# Altium project Cam_control.PrjPCB
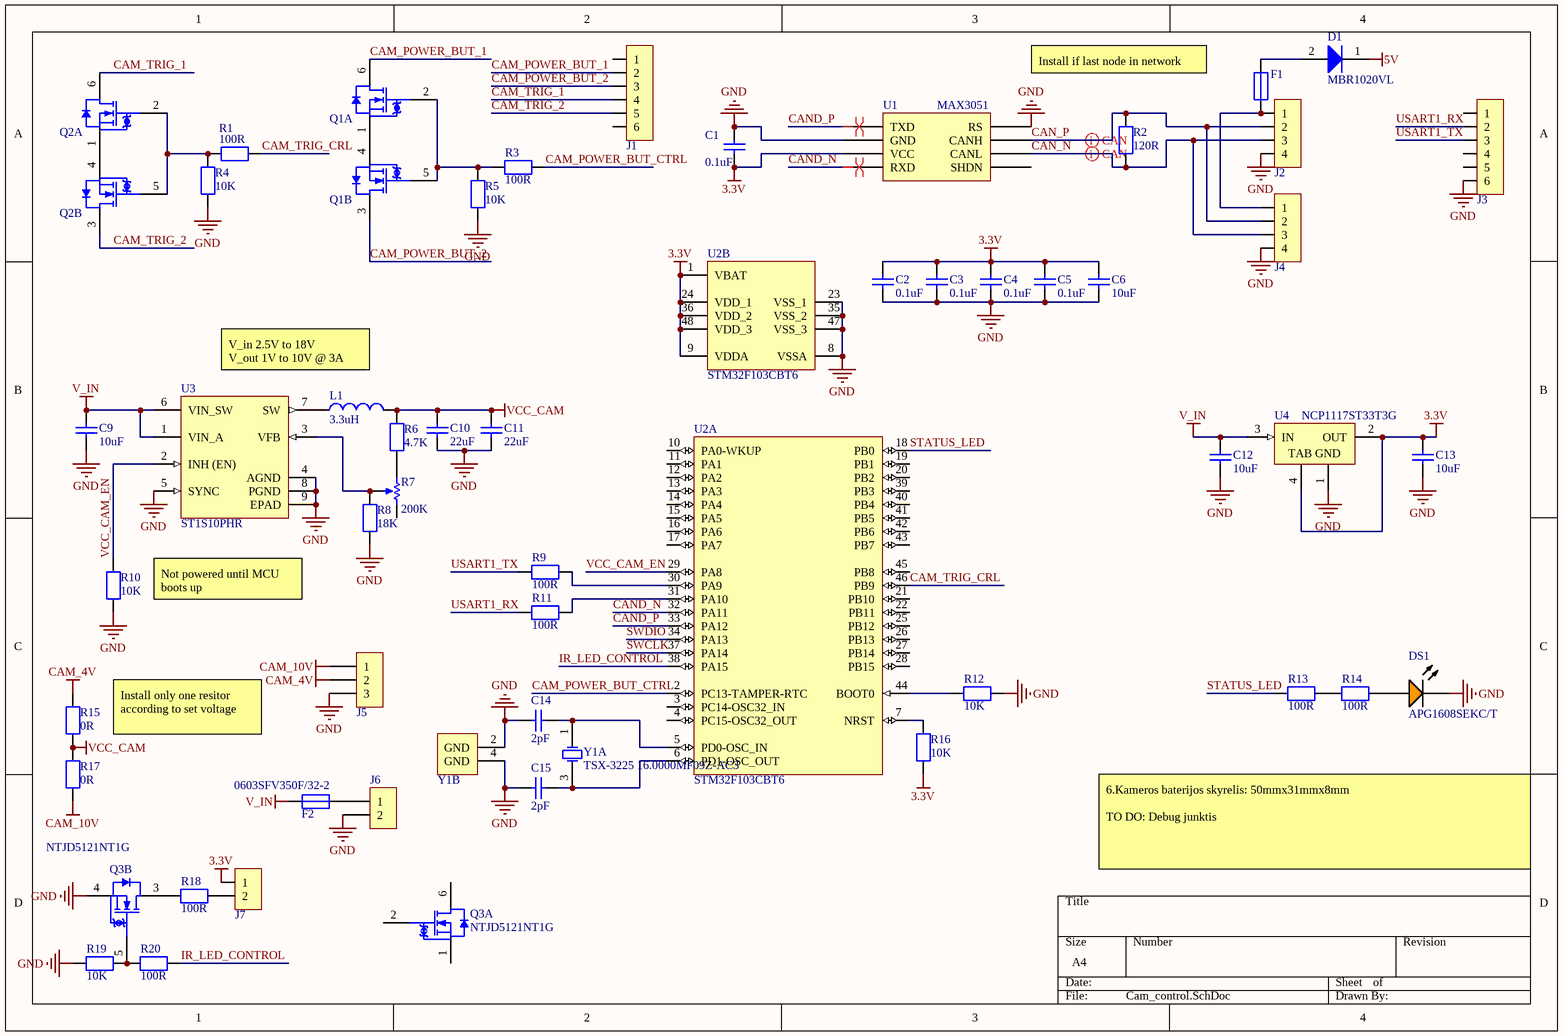
[diagram p0: Cam_control.SchDoc]
1 sheet, 53 parts. Net scope: global (net labels, ports and power ports of the same name join across sheets).
Board file: Cam_control.PcbDoc

## Sheet Cam_control.SchDoc
size A4; Author: Matas

### Parts
C1  value 0.1uF  [0603_CAP]  (hidden comment: Capacitor)
C2  value 0.1uF  [0603_CAP]  (hidden comment: Capacitor)
C3  value 0.1uF  [0603_CAP]  (hidden comment: Capacitor)
C4  value 0.1uF  [0603_CAP]  (hidden comment: Capacitor)
C5  value 0.1uF  [0603_CAP]  (hidden comment: Capacitor)
C6  value 10uF  [1206_CAP]  (hidden comment: Capacitor)
C9  value 10uF  [1206_CAP]  (hidden comment: Capacitor)
C10  value 22uF  [0805_CAP]  (hidden comment: Capacitor)
C11  value 22uF  [0805_CAP]  (hidden comment: Capacitor)
C12  value 10uF  [1206_CAP]  (hidden comment: Capacitor)
C13  value 10uF  [1206_CAP]  (hidden comment: Capacitor)
C14  value 2pF  [0603_CAP]  (hidden comment: Capacitor)
C15  value 2pF  [0603_CAP]  (hidden comment: Capacitor)
D1  MBR1020VL  [SOD-123-2]
DS1  APG1608SEKC/T  [KING-LED0603-25-ORANGE_V]
F1  Fuse  [0603_RES]  (value not drawn)
F2  0603SFV350F/32-2  [0603_RES]
J1  DF13-6P / 1.25mm Pitch Miniature Crimping Connector.  [DF13-6P-1.25DS]  (value not drawn)
J2  DF13-4P / 1.25mm Pitch Miniature Crimping Connector.  [DF13-4P-1.25DS]  (value not drawn)
J3  DF13-6P / 1.25mm Pitch Miniature Crimping Connector.  [DF13-6P-1.25DS]  (value not drawn)
J4  DF13-4P / 1.25mm Pitch Miniature Crimping Connector.  [DF13-4P-1.25DS]  (value not drawn)
J5  Molex - Micro-Fit 3.0 Series connector,  3.00mm (0.118") pitch header, 3 positions.  [43650-0300]  (value not drawn)
J6  Micro-Fit 3.0, 3.00mm pitch header  [43650-0200]  (value not drawn)
J7  DF13-2P / 1.25mm Pitch Miniature Crimping Connector.  [DF13-2P-1.25DS]  (value not drawn)
L1  value 3.3uH  [ASPI0530]  (hidden comment: Inductor)
Q1  NTJD5121NT1G  [ONSC-SC70-6-419B-02_V]  (value not drawn)  (parts A,B of 2)
Q2  NTJD5121NT1G  [ONSC-SC70-6-419B-02_V]  (value not drawn)  (parts A,B of 2)
Q3  NTJD5121NT1G  [ONSC-SC70-6-419B-02_V]  (parts A,B of 2)
R1  value 100R  [0603_RES]  (hidden comment: Resitor)
R2  value 120R  [0603_RES]  (hidden comment: Resitor)
R3  value 100R  [0603_RES]  (hidden comment: Resitor)
R4  value 10K  [0603_RES]  (hidden comment: Resitor)
R5  value 10K  [0603_RES]  (hidden comment: Resitor)
R6  value 4.7K  [0603_RES]  (hidden comment: Resitor)
R7  value 200K  [TC33X-2]  (hidden comment: Potenciometer)
R8  value 18K  [0603_RES]  (hidden comment: Resitor)
R9  value 100R  [0603_RES]  (hidden comment: Resitor)
R10  value 10K  [0603_RES]  (hidden comment: Resitor)
R11  value 100R  [0603_RES]  (hidden comment: Resitor)
R12  value 10K  [0603_RES]  (hidden comment: Resitor)
R13  value 100R  [0603_RES]  (hidden comment: Resitor)
R14  value 100R  [0603_RES]  (hidden comment: Resitor)
R15  value 0R  [0603_RES]  (hidden comment: Resitor)
R16  value 10K  [0603_RES]  (hidden comment: Resitor)
R17  value 0R  [0603_RES]  (hidden comment: Resitor)
R18  value 100R  [0603_RES]  (hidden comment: Resitor)
R19  value 10K  [0603_RES]  (hidden comment: Resitor)
R20  value 100R  [0603_RES]  (hidden comment: Resitor)
U1  MAX3051  [SOIC127P600X175-8M]
U2  STM32F103CBT6  [STM-LQFP48_L]  (parts A,B of 2)
U3  ST1S10PHR  [HSO-8_L]
U4  NCP1117ST33T3G  [ONSC-SOT-223_M]
Y1  TSX-3225 16.0000MF09Z-AC3  [TSX-3225]  (parts A,B of 2)

### Nets
3.3V: C1.1 C2.2 C3.2 C4.2 C5.2 C6.2 C13.2 J7.1 R16.1 U1.3(VCC) U2.1(VBAT) U2.9(VDDA) U2.24(VDD_1) U2.36(VDD_2) U2.48(VDD_3) U4.2(OUT) U4.4(TAB)
5V: D1.1(K)
CAM_4V: J5.2 R15.2
CAM_10V: J5.1 R17.1
GND: C1.2 C2.1 C3.1 C4.1 C5.1 C6.1 C9.1 C10.1 C11.1 C12.1 C13.1 C14.1 C15.1 DS1.2(K) J2.4 J3.6 J4.4 J5.3 J6.2 Q3.4(S2) R4.1 R5.1 R8.1 R10.1 R12.1 R19.2 U1.2(GND) U1.8(RS) U2.8(VSSA) U2.23(VSS_1) U2.35(VSS_2) U2.47(VSS_3) U3.4(AGND) U3.5(SYNC) U3.8(PGND) U3.9(EPAD) U4.1(GND) Y1.2(GND) Y1.4(GND)
V_IN: C9.2 C12.2 F2.1 U3.1(VIN_A) U3.6(VIN_SW) U4.3(IN)
VCC_CAM: C10.2 C11.2 L1.2 R6.2 R15.1 R17.2
CAM_POWER_BUT_1: J1.2 Q1.6(D1)
CAM_POWER_BUT_2: J1.3 Q1.3(D2)
CAM_POWER_BUT_CTRL: R3.2 U2.2(PC13-TAMPER-RTC)
CAM_TRIG_1: J1.4 Q2.6(D1)
CAM_TRIG_2: J1.5 Q2.3(D2)
CAM_TRIG_CRL: R1.2 U2.46(PB9)
CAN_N: J2.3 J4.3 R2.1 U1.6(CANL)
CAN_P: J2.2 J4.2 R2.2 U1.7(CANH)
CAND_N: U1.4(RXD) U2.32(PA11)
CAND_P: U1.1(TXD) U2.33(PA12)
IR_LED_CONTROL: R20.2 U2.38(PA15)
STATUS_LED: R13.1 U2.18(PB0)
SWCLK: U2.37(PA14)
SWDIO: U2.34(PA13)
USART1_RX: J3.2 R11.1
USART1_TX: J3.3 R9.1
VCC_CAM_EN: R10.2 U2.29(PA8) U3.2(INH_(EN))
NetC14_2: C14.2 U2.5(PD0-OSC_IN) Y1.1(X1)
NetC15_2: C15.2 U2.6(PD1-OSC_OUT) Y1.3(X2)
NetD1_2: D1.2(A) F1.2
NetDS1_1: DS1.1(A) R14.2
NetF1_1: F1.1 J2.1 J4.1
NetF2_2: F2.2 J6.1
NetJ7_2: J7.2 R18.2
NetL1_1: L1.1 U3.7(SW)
NetQ1_1: Q1.1(S1) Q1.4(S2)
NetQ1_2: Q1.2(G1) Q1.5(G2) R3.1 R5.2
NetQ2_1: Q2.1(S1) Q2.4(S2)
NetQ2_2: Q2.2(G1) Q2.5(G2) R1.1 R4.2
NetQ3_3: Q3.3(D2) R18.1
NetQ3_5: Q3.5(G2) R19.1 R20.1
NetR6_1: R6.1 R7.1(CCW)
NetR7_2: R7.2(WIPER) R8.2 U3.3(VFB)
NetR9_2: R9.2 U2.30(PA9)
NetR11_2: R11.2 U2.31(PA10)
NetR12_2: R12.2 U2.44(BOOT0)
NetR13_2: R13.2 R14.1
NetR16_2: R16.2 U2.7(NRST)

Not connected (* = marked no-connect by the designer): J1 1 6; J3 1 4 5; Q3 1(S1) 2(G1) 6(D1); R7 3(CW); U1 5(SHDN); U2 3(PC14-OSC32_IN) 4(PC15-OSC32_OUT) 10(PA0-WKUP) 11(PA1) 12(PA2) 13(PA3) 14(PA4) 15(PA5) 16(PA6) 17(PA7) 19(PB1) 20(PB2) 21(PB10) 22(PB11) 25(PB12) 26(PB13) 27(PB14) 28(PB15) 39(PB3) 40(PB4) 41(PB5) 42(PB6) 43(PB7) 45(PB8)

### Layout directives
differential pair: CAN_N, CAN_P, CAND_N, CAND_P

### Notes on the sheet
- Install if last node in network
- V_in 2.5V to 18V
  V_out 1V to 10V @ 3A
- Not powered until MCU boots up
- Install only one resitor according to set voltage
- 6.Kameros baterijos skyrelis: 50mmx31mmx8mm
  TO DO: Debug junktis

### Library data of the parts
C1-C6 C9-C15 = Capacitor: Max_V: 25V
D1 = Diode
DS1 = CMP-0239-00002-1: LED, SMT, 0603(1608), 0.25mm Tthickness, Super Bright Orange; Forward Current: 30 mA; Power Dissipation: 75 mW; Reverse Voltage: 5 V; Packing: Reel; PackageDescription: 2-Pin SMT LED, 1.6 x 0.8 mm Body, 0.25mm Thickness; ComponentLink1URL: http://www.kingbrightusa.com/; PackageVersion: Rev. 4A, 12/2011; Storage Temperature: -40 to 85 degC; PartNumber: APG1608SEKC/T; Mounting Technology: Surface Mount; ComponentLink2Description: Datasheet; DatasheetVersion: Rev. 4A, 12/2011; ComponentLink2URL: http://www.kingbrightusa.com/images/catalog/SPEC/APG1608SEKC-T.pdf; PackageReference: LED0603-25-ORANGE; ComponentLink1Description: Manufacturer URL
F2 = Fuse: I_max: 3.5A
J1 J3 = DF13-6P-1.25DS
J2 J4 = DF13-4P-1.25DS
J5 = HEADER_POS3_?43650-0300
J6 = HEADER_POS2_?43650-0200
J7 = DF13-2P-1.25DS
Q1-Q3 = CMP-1058-00623-1: Power MOSFET, 60 V, 295 mA, Dual N-Channel with ESD Protection, 6-Pin SC70, Pb-Free, Tape and Reel; Manufacturer: On Semiconductor; Crss Typ (pF): 2.5; Ciss Typ (pF): 26; ID Max (A): 0.295; V(BR)DSS Min (V): 60; Channel Polarity: N Channel; Coss Typ (pF): 4.4; VGS Max (V): 20; DatasheetVersion: Rev. 6; PackageDescription: 6-Pin Small Outline Transistor, Body 2 x 1.25 mm, Pitch 0.65 mm; Package Type: SC-88-6; ComponentLink3URL: http://www.onsemi.com/pub_link/Collateral/419B-02.PDF; PartNumber: NTJD5121NT1G; PackageVersion: Rev. Y, 12/2012; Packing: Tape and Reel; PackageReference: SC70-6-419B-02; Configuration: Dual; ComponentLink1Description: Manufacturer URL; ComponentLink1URL: http://www.onsemi.com/; ComponentLink2Description: Datasheet; ComponentLink2URL: http://www.onsemi.com/pub_link/Collateral/NTJD5121N-D.PDF; ComponentLink3Description: Package Specification; Mounting Technology: Surface Mount; VGS(th) Max (V): 2.5; RoHS: Pb-Free
  Q3: PartId: 1
U2 = CMP-0237-00250-3: ARM Cortex-M3 32-bit MCU, 128 KB Flash, 20 KB Internal RAM, 37 I/Os, 48-pin LQFP, -40 to 85 degC, Tray; Supply Voltage(Vcc) min (V): 2; Operating Frequency(F) (Processor speed) (MHz): 72; A/D Converter: 2x12-bit (10 Channel); FLASH Size (Prog) (kB): 128; Internal RAM Size (kB): 20; I/Os (High Current): 37; ComponentLink2Description: Datasheet; PackageReference: LQFP48; PartNumber: STM32F103CBT6; ComponentLink1Description: Manufacturer URL; DatasheetVersion: Rev. 16; PackageVersion: Rev. 6, 06/2013; Packing: Tray; ComponentLink1URL: http://www.st.com/web/en/home.html; Mounting Technology: Surface Mount; ComponentLink3URL: http://www.st.com/st-web-ui/static/active/en/resource/technical/document/datasheet/DM00058181.pdf; PackageDescription: 48-Pin Low Profile Quad Flat Package, 7 x 7 mm Body, 0.5 mm Pitch; Core: ARM Cortex-M3; ComponentLink3Description: Package Specification; ComponentLink2URL: http://www.st.com/st-web-ui/static/active/en/resource/technical/document/datasheet/CD00161566.pdf
U3 = CMP-0240-00113-1: Monolithic synchronous step-down regulator, 8-Pin HSOP, Tape and Reel; ComponentLink2Description: Datasheet; PackageDescription: 8-Pin Small Outline Integrated Circuit 1.27 mm Pitch; ComponentLink2URL: http://www.st.com/internet/com/TECHNICAL_RESOURCES/TECHNICAL_LITERATURE/DATASHEET/CD00169322.pdf; ComponentLink1Description: Manufacturer URL; PackageVersion: 2007; DatasheetVersion: Mar-2011; PackageReference: HSO-8; ComponentLink1URL: http://www.st.com
U4 = CMP-0592-00001-1: 1.0 A Low-Dropout Positive Fixed Voltage Regulator, 5 V Vout, 0 to 125 degC, 4-Pin SOT-223, Pb-Free, Tape and Reel; Manufacturer: ON Semiconductor; Dropout Voltage: 1.2 V; RR: 61 dB; Vin: 20 V; IQ: 6 mA; Iout (Min): 1 A; Nominal Output Voltage: 5 V; DatasheetVersion: Rev. 26; ComponentLink1URL: http://www.onsemi.com/; Operating Temperature: 0 to 125 degC; PackageReference: SOT-223; ComponentLink1Description: Manufacturer URL; PackageDescription: 4-Pin Small Out-Line Transistor, Body 3.5 x 6.5 mm, Pitch 2.3 mm; ComponentLink2URL: http://www.onsemi.com/pub_link/Collateral/NCP1117-D.PDF; PartNumber: NCP1117ST33T3G; ComponentLink3URL: http://www.onsemi.com/pub_link/Collateral/318H-01.PDF; ComponentLink2Description: Datasheet; Packing: Tape and Reel; ComponentLink3Description: Package Specification; Mounting Technology: Surface Mount